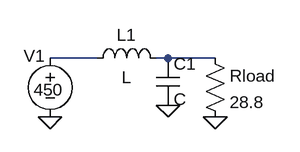
[diagram p0: schematic withfet.asc]
withfet.asc, the LTspice schematic file:
Version 4
SHEET 1 880 680
WIRE 160 80 96 80
WIRE 256 80 240 80
WIRE 320 80 256 80
FLAG 96 160 0
FLAG 256 144 0
FLAG 320 160 0
SYMBOL voltage 96 64 R0
WINDOW 0 -36 13 Left 2
WINDOW 3 -22 59 Left 2
WINDOW 123 0 0 Left 2
WINDOW 39 0 0 Left 2
SYMATTR InstName V1
SYMATTR Value 450
SYMBOL res 304 64 R0
SYMATTR InstName Rload
SYMATTR Value 28.8
SYMBOL ind 144 96 R270
WINDOW 0 32 56 VTop 2
WINDOW 3 5 56 VBottom 2
SYMATTR InstName L1
SYMBOL cap 240 80 R0
SYMATTR InstName C1

The netlist it stands for:
* withfet.asc
V1 N001 0 450
Rload N002 0 28.8
L1 N001 N002 L
C1 N002 0 C
.backanno
.end